# Altium schematic sheet isolation.SchDoc
size A4; SheetNumber: 3; SheetTotal: 7
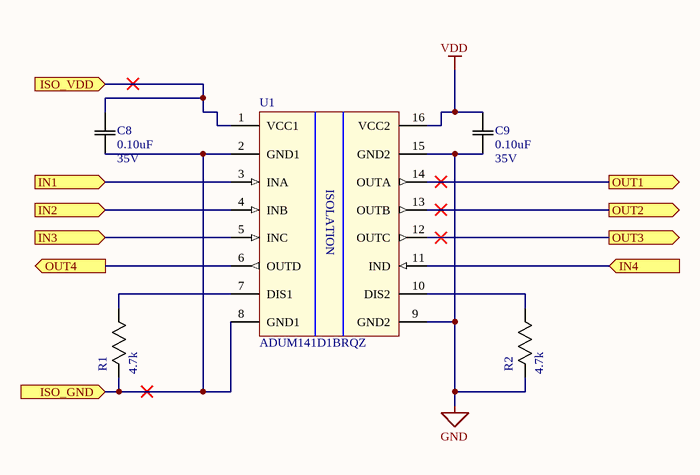
[diagram p0: isolation.SchDoc]

## Parts
C8  Rating: 35V  [0603]  (hidden comment: 0.10uF)
C9  Rating: 35V  [0603]  (hidden comment: 0.10uF)
R1  4.7k  [0603]
R2  4.7k  [0603]
U1  ADUM141D1BRQZ  [SOP64P600X175-16N]

## Ports
IN1 (in), IN2 (in), IN3 (in), IN4 (in), ISO_GND (in), ISO_VDD (in), OUT1 (out), OUT2 (out), OUT3 (out), OUT4 (out)

## Nets
GND: C9.1(C1) R2.2(R2) U1.9(GND2) U1.15(GND2)
VDD: C9.2(C2) U1.16(VCC2)
IN1: U1.3(INA) ; port IN1
IN2: U1.4(INB) ; port IN2
IN3: U1.5(INC) ; port IN3
IN4: U1.11(IND) ; port IN4
ISO_GND: C8.1(C1) R1.2(R2) U1.2(GND1) U1.8(GND1) ; port ISO_GND
ISO_VDD: C8.2(C2) U1.1(VCC1) ; port ISO_VDD
OUT1: U1.14(OUTA) ; port OUT1
OUT2: U1.13(OUTB) ; port OUT2
OUT3: U1.12(OUTC) ; port OUT3
OUT4: U1.6(OUTD) ; port OUT4
NetR1_1: R1.1(R1) U1.7(DIS1)
NetR2_1: R2.1(R1) U1.10(DIS2)

## Notes on the sheet
- (in symbol ISO ADUM141D1BRQZ) ISOLATION

## Library data of the parts
C8 C9 = CAP 0.10uF 35V: CAP CER 0.10UF 35V X7R 0603/0805; Tolerance: 10%; Package: 0603/0805; Temperature Coefficient: X7R; Operating Temperature: -55°C ~ 125°C; Value: 0.10uF
R1 R2 = RES 4.7k 1/8W - 5%: RES SMD 4.7k OHM 5% 1/8W 0805; Power (Watts): 0.125W; Package: 0805; Value: 4.7k; Tolerance: 5%
U1 = ISO ADUM141D1BRQZ: DGTL ISO 3.75KV 4CH SPI 16SSOP 3/1